# EAGLE design e407-sensor-shield (EAGLE 6.4)
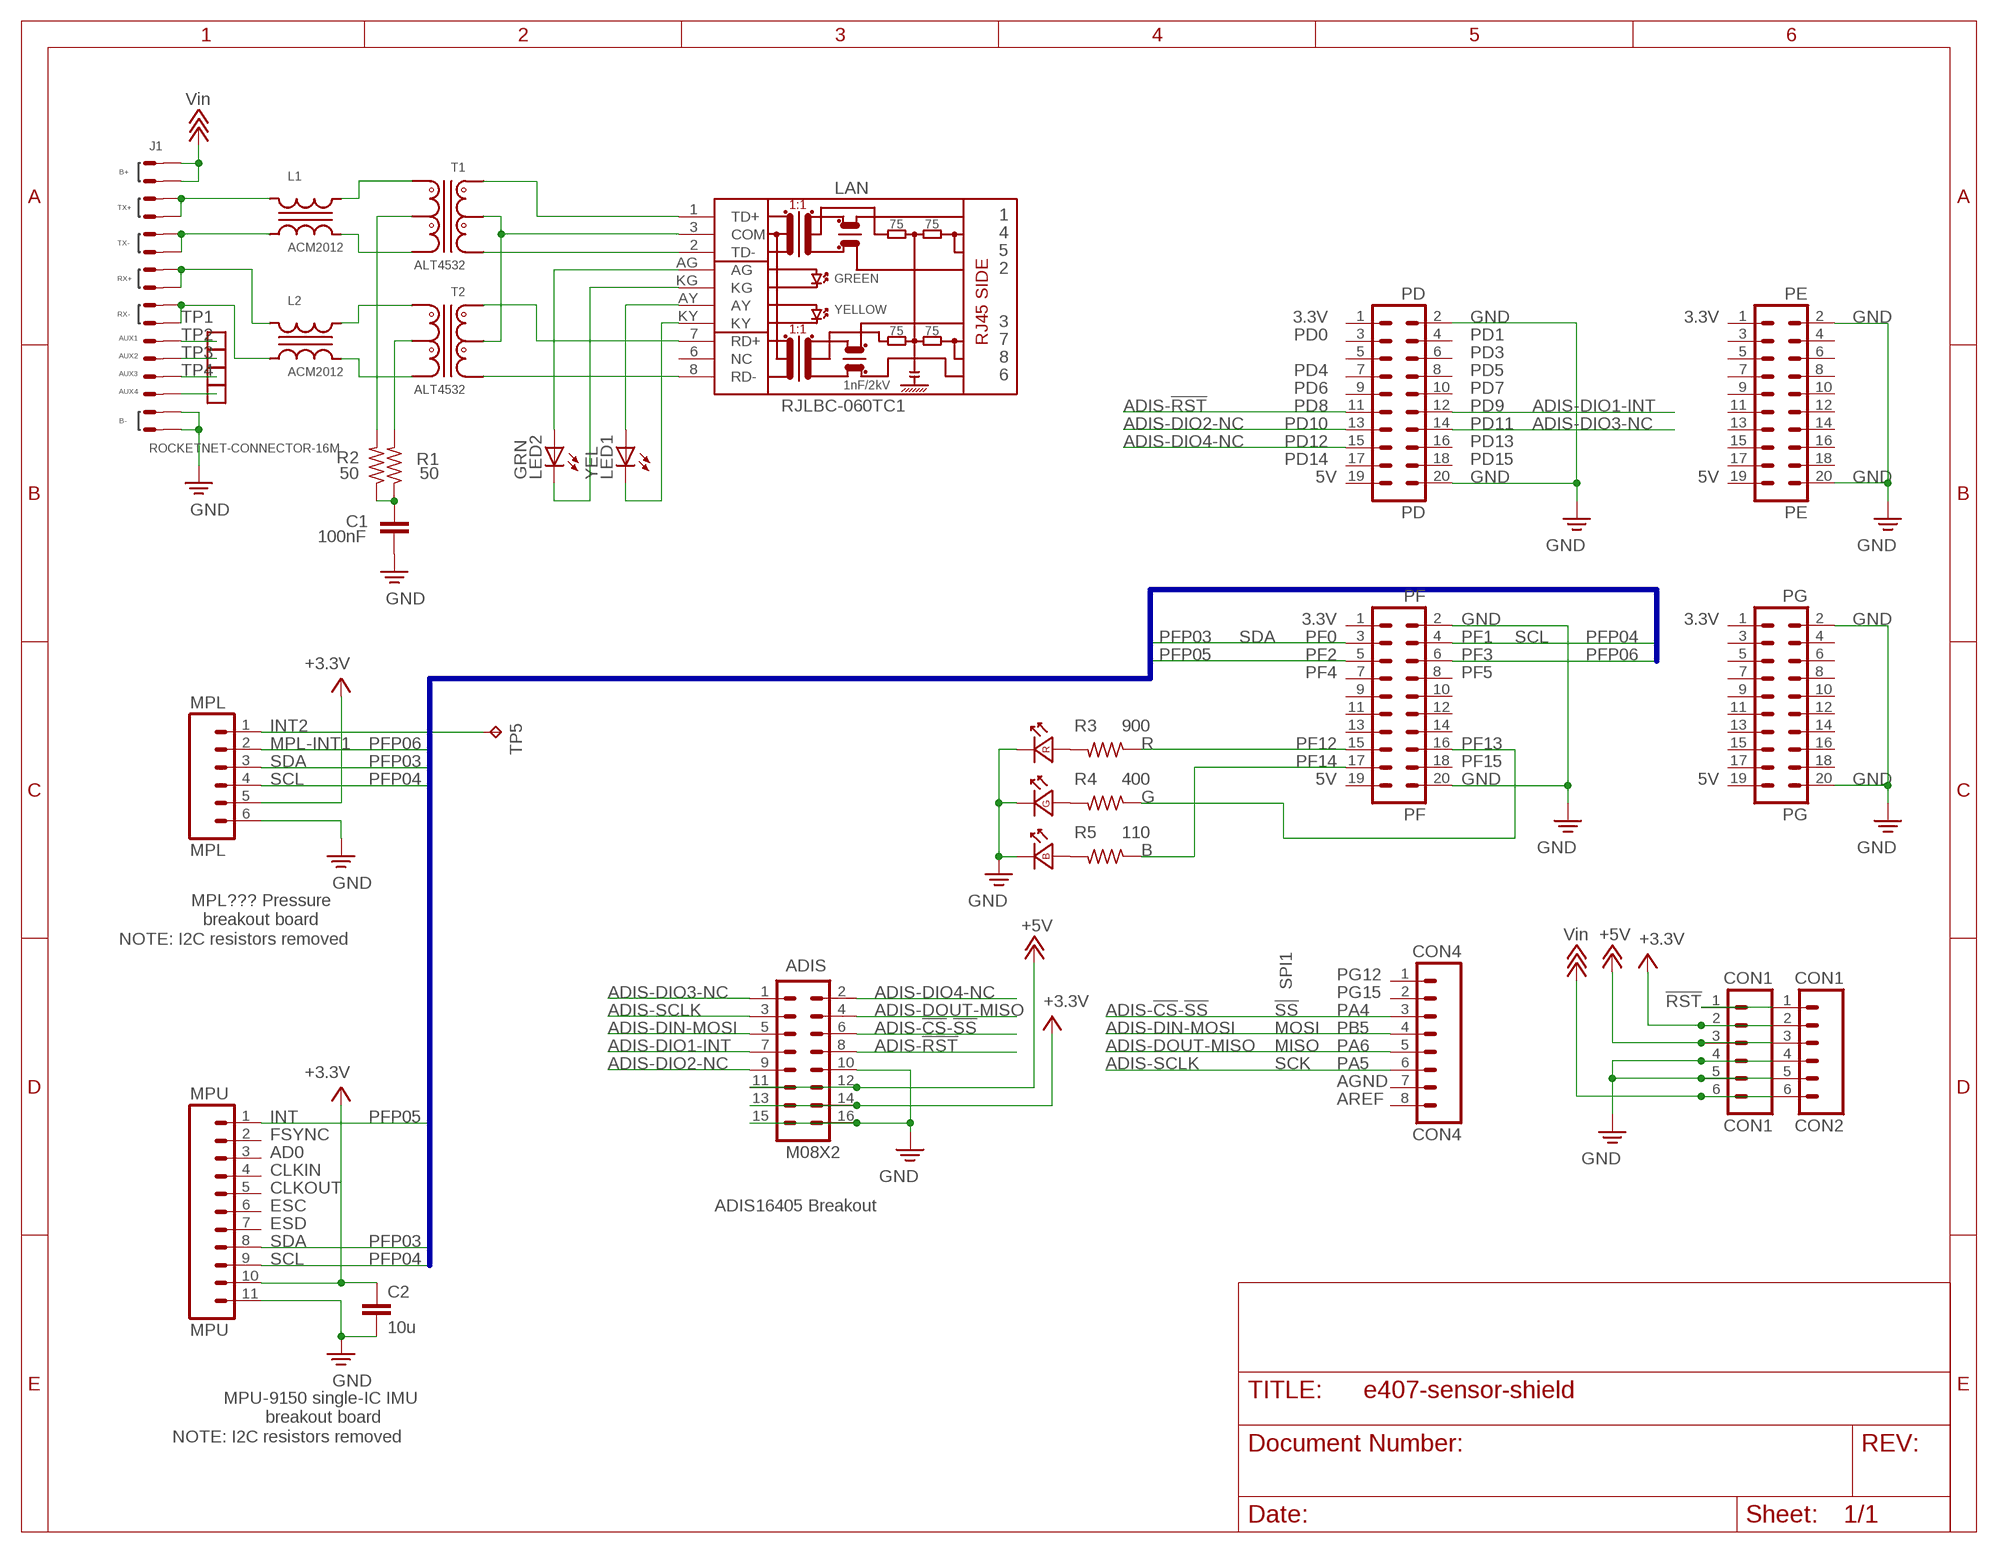
[diagram p0: schematic, sheet 1]

## Parts
ADIS  M08X2  [2X8]
C1  100nF  C-EU0603-B-NOSILK  [0603-B-NOSILK]
C2  10u  C-EU0805-B-NOSILK  [0805-B-NOSILK]
CON1  CON1  M06SIP  [1X06]
CON2  CON1  M06SIP  [1X06]
CON4  CON4  M081X08  [1X08]
J1  ROCKETNET-CONNECTOR-16M  [ROCKETNET-M-16]
L1  ACM2012  [TDK-ACM2012]
L2  ACM2012  [TDK-ACM2012]
LAN  RJLBC-060TC1  [RJLBC-060TC1]
LED1  YEL  LEDCHIPLED_0603  [CHIPLED_0603]
LED2  GRN  LEDCHIPLED_0603  [CHIPLED_0603]
LED3  LED_RGB_PLCC-6  [PLCC-6]
MPL  MPL  M06SIP  [1X06]
MPU  MPU  M11PTH  [1X11]
PD  PD  ML20  [ML20]
PE  PE  ML20  [ML20]
PF  PF  ML20  [ML20]
PG  PG  ML20  [ML20]
R1  50  R-US_0603-B-NOSILK  [0603-B-NOSILK]
R2  50  R-US_0603-B-NOSILK  [0603-B-NOSILK]
R3  900  R-US_0603-B-NOSILK  [0603-B-NOSILK]
R4  400  R-US_0603-B-NOSILK  [0603-B-NOSILK]
R5  110  R-US_0603-B-NOSILK  [0603-B-NOSILK]
T1  ALT4532  [TDK-ALT4532]
T2  ALT4532  [TDK-ALT4532]
TP1  TEST-POINT  [2MM-TEST-POINT]
TP2  TEST-POINT  [2MM-TEST-POINT]
TP3  TEST-POINT  [2MM-TEST-POINT]
TP4  TEST-POINT  [2MM-TEST-POINT]
TP5  TPPAD1-13  [P1-13]

## Nets
ADIS-!CS!-!SS: ADIS.6 CON4.3
ADIS-!RST: ADIS.8 PD.11
ADIS-DIN-MOSI: ADIS.5 CON4.4
ADIS-DIO1-INT: ADIS.7 PD.12
ADIS-DIO2-NC: ADIS.9 PD.13
ADIS-DIO3-NC: ADIS.1 PD.14
ADIS-DIO4-NC: ADIS.2 PD.15
ADIS-DOUT-MISO: ADIS.4 CON4.5
ADIS-SCLK: ADIS.3 CON4.6
B: PF.17 R5.1
DOUBLE_UP_ARROW: ADIS.11 ADIS.12 CON1.3 CON2.3 ; supply symbol labelled +5V
G: PF.16 R4.1
MPL-INT1: MPL.2 PF.6
N$3: L1.4 T1.5
N$4: CON1.1 CON2.1
N$5: L1.3 T1.4
N$6: L2.4 T2.5
N$7: L2.3 T2.4
N$8: J1.T+@13(TX+) J1.T+@14(TX+) L1.1
N$9: J1.T-@9(TX-) J1.T-@11(TX-) L1.2
N$10: J1.R+@5(RX+) J1.R+@7(RX+) L2.1
N$11: LAN.1(TD+) T1.1
N$12: LAN.2(TD-) T1.2
N$13: LAN.7(RD+) T2.1
N$14: LAN.8(RD-) T2.2
N$15: LAN.KY LED1.C
N$16: LAN.AY LED1.A
N$17: LAN.KG LED2.C
N$18: LAN.AG LED2.A
N$19: J1.R-@3(RX-) J1.R-@4(RX-) L2.2
N$20: J1.A4(AUX4) TP4.1
N$21: J1.A3(AUX3) TP3.1
N$22: J1.A2(AUX2) TP2.1
N$23: J1.A1(AUX1) TP1.1
N$24: LAN.3(COM) T1.6 T2.6
N$25: C1.1 R1.1 R2.1
N$26: R1.2 T2.3
N$27: R2.2 T1.3
N$28: LED3.1(R:A) R3.2
N$29: LED3.3(G:A) R4.2
N$30: LED3.4(B:A) R5.2
PFP03: MPL.3 MPU.8 PF.3
PFP04: MPL.4 MPU.9 PF.4
PFP05: MPU.1 PF.5
PFP07: MPL.1 TP5.TP
R: PF.15 R3.1
TRIPLE_BAR_GND: ADIS.10 ADIS.15 ADIS.16 C1.2 C2.2 CON1.4 CON1.5 CON2.4 CON2.5 J1.B-@1(B-) J1.B-@2(B-) LED3.2(G:K) LED3.5(B:K) LED3.6(R:K) MPL.6 MPU.11 PD.2 PD.20 PE.2 PE.20 PF.2 PF.20 PG.2 PG.20 ; supply symbol labelled GND
TRIPLE_UP_ARROW: CON1.6 CON2.6 J1.B+@15(B+) J1.B+@16(B+) ; supply symbol labelled Vin
UP_ARROW: ADIS.13 ADIS.14 C2.1 CON1.2 CON2.2 MPL.5 MPU.10 ; supply symbol labelled +3.3V
Unconnected: CON4.1 CON4.2 CON4.7 CON4.8 LAN.6(NC) MPU.2 MPU.3 MPU.4 MPU.5 MPU.6 MPU.7 PD.1 PD.3 PD.4 PD.5 PD.6 PD.7 PD.8 PD.9 PD.10 PD.16 PD.17 PD.18 PD.19 PE.1 PE.3 PE.4 PE.5 PE.6 PE.7 PE.8 PE.9 PE.10 PE.11 PE.12 PE.13 PE.14 PE.15 PE.16 PE.17 PE.18 PE.19 PF.1 PF.7 PF.8 PF.9 PF.10 PF.11 PF.12 PF.13 PF.14 PF.18 PF.19 PG.1 PG.3 PG.4 PG.5 PG.6 PG.7 PG.8 PG.9 PG.10 PG.11 PG.12 PG.13 PG.14 PG.15 PG.16 PG.17 PG.18 PG.19

## Buses
B$1

## Notes on the sheet
- 3.3V | GND | 3.3V | GND
- PD0 | PD1
- PD3
- PD4 | PD5
- PD6 | PD7
- PD8 | PD9
- PD10 | PD11
- PD12 | PD13
- PD14 | PD15
- 5V | GND | 5V | GND
- 3.3V | GND | 3.3V | GND
- PFP03 | SDA | PF0 | PF1 | SCL | PFP04
- PFP05 | PF2 | PF3 | PFP06
- PF4 | PF5
- INT2
- PFP06 | PF12 | PF13
- SDA | PFP03 | PF14 | PF15
- SCL | PFP04 | 5V | GND | 5V | GND
- MPL??? Pressure
  breakout board
- NOTE: I2C resistors removed
- PG12
- SPI1
- PG15
- !RST
- !SS | PA4
- MOSI | PB5
- MISO | PA6
- SCK | PA5
- AGND
- AREF
- INT | PFP05
- FSYNC
- AD0
- CLKIN
- CLKOUT
- ESC | ADIS16405 Breakout
- ESD
- SDA | PFP03
- SCL | PFP04
- MPU-9150 single-IC IMU 
  breakout board
- NOTE: I2C resistors removed

## Library data of the parts
ADIS = SparkFun-Connectors:M08X2: .1" headers, two rows of 8 each
C1 C2 = rcl_custom:C-EU: CAPACITOR, European symbol
CON1 CON2 MPL = SparkFun-Connectors:M06: Header 6 Standard 6-pin 0.1" header. Use with straight break away headers (SKU : PRT-00116), right angle break away headers (PRT-00553), swiss pins (PRT-00743), machine pins (PRT-00117), and female headers (PRT-00115). Molex polarized connector foot print use with SKU : PRT-08094 with associated crimp pins and housings. NOTES ON THE VARIANTS LOCK and LOCK_LONGPADS... This footprint was designed to help hold the alignment of a through-hole component (i.e. 6-pin header) while soldering it into place. You may notice that each hole has been shifted either up or down by 0.005 of an inch from it's more standard position (which is a perfectly straight line). This slight alteration caused the pins (the squares in the middle) to touch the edges of the holes. Because they are alternating, it causes a "brace" to hold the component in place. 0.005 has proven to be the perfect amount of "off-center" position when using our standard breakaway headers. Although looks a little odd when you look at the bare footprint, once you have a header in there, the alteration is very hard to notice. Also, if you push a header all the way into place, it is covered up entirely on the bottom side. This idea of altering the position of holes to aid alignment will be further integrated into the Sparkfun Library for other footprints. It can help hold any component with 3 or more connection pins.
CON4 = SparkFun-Connectors:M08: Header 8 Standard 8-pin 0.1" header. Use with straight break away headers (SKU : PRT-00116), right angle break away headers (PRT-00553), swiss pins (PRT-00743), machine pins (PRT-00117), and female headers (PRT-00115).
J1 = rocketnet-connector:ROCKETNET-CONNECTOR-16
L1 L2 = magnetics:ACM2012
LAN = OLIMEX_CONNECTORS:RJLBC-060TC1
LED1 LED2 = led:LED: LED OSRAM: - CHIPLED LG R971, LG N971, LY N971, LG Q971, LY Q971, LO R971, LY R971 LH N974, LH R974 LS Q976, LO Q976, LY Q976 LO Q996 - Hyper CHIPLED LW Q18S LB Q993, LB Q99A, LB R99A - SideLED LS A670, LO A670, LY A670, LG A670, LP A670 LB A673, LV A673, LT A673, LW A673 LH A674 LY A675 LS A676, LA A676, LO A676, LY A676, LW A676 LS A679, LY A679, LG A679 - Hyper Micro SIDELED® LS Y876, LA Y876, LO Y876, LY Y876 LT Y87S - SmartLED LW L88C, LW L88S LB L89C, LB L89S, LG L890 LS L89K, LO L89K, LY L89K LS L896, LA L896, LO L896, LY L896 - TOPLED LS T670, LO T670, LY T670, LG T670, LP T670 LSG T670, LSP T670, LSY T670, LOP T670, LYG T670 LG T671, LOG T671, LSG T671 LB T673, LV T673, LT T673, LW T673 LH T674 LS T676, LA T676, LO T676, LY T676, LB T676, LH T676, LSB T676, LW T676 LB T67C, LV T67C, LT T67C, LS T67K, LO T67K, LY T67K, LW E67C LS E67B, LA E67B, LO E67B, LY E67B, LB E67C, LV E67C, LT E67C LW T67C LS T679, LY T679, LG T679 LS T770, LO T770, LY T770, LG T770, LP T770 LB T773, LV T773, LT T773, LW T773 LH T774 LS E675, LA E675, LY E675, LS T675 LS T776, LA T776, LO T776, LY T776, LB T776 LHGB T686 LT T68C, LB T68C - Hyper Mini TOPLED® LB M676 - Mini TOPLED Santana® LG M470 LS M47K, LO M47K, LY M47K Source: http://www.osram.convergy.de LUXEON: - LUMILED® LXK2-PW12-R00, LXK2-PW12-S00, LXK2-PW14-U00, LXK2-PW14-V00 LXK2-PM12-R00, LXK2-PM12-S00, LXK2-PM14-U00 LXK2-PE12-Q00, LXK2-PE12-R00, LXK2-PE12-S00, LXK2-PE14-T00, LXK2-PE14-U00 LXK2-PB12-K00, LXK2-PB12-L00, LXK2-PB12-M00, LXK2-PB14-N00, LXK2-PB14-P00, LXK2-PB14-Q00 LXK2-PR12-L00, LXK2-PR12-M00, LXK2-PR14-Q00, LXK2-PR14-R00 LXK2-PD12-Q00, LXK2-PD12-R00, LXK2-PD12-S00 LXK2-PH12-R00, LXK2-PH12-S00 LXK2-PL12-P00, LXK2-PL12-Q00, LXK2-PL12-R00 Source: www.luxeon.com KINGBRIGHT: KA-3528ASYC Source: www.kingbright.com
LED3 = Tova:LED_RGB_*: RGB LED with separate contacts for all 3 chips
MPU = SparkFun-Connectors:M11: Header 11 Standard 11-pin 0.1" header. Use with straight break away headers (SKU : PRT-00116), right angle break away headers (PRT-00553), swiss pins (PRT-00743), machine pins (PRT-00117), and female headers (PRT-00115).
PD PE PF PG = con-harting-ml:ML20: HARTING; OC_FARNELL: unknown; OC_NEWARK: unknown
R1-R5 = rcl_custom:R-US_: RESISTOR, American symbol
T1 T2 = magnetics:ALT4532
TP1-TP4 = apdm:TEST-POINT
TP5 = testpad:TP: Test pad

## Net classes
1 PWR: width 0.203 mm, drill 0.4 mm, clearance 0.076 mm

## Board
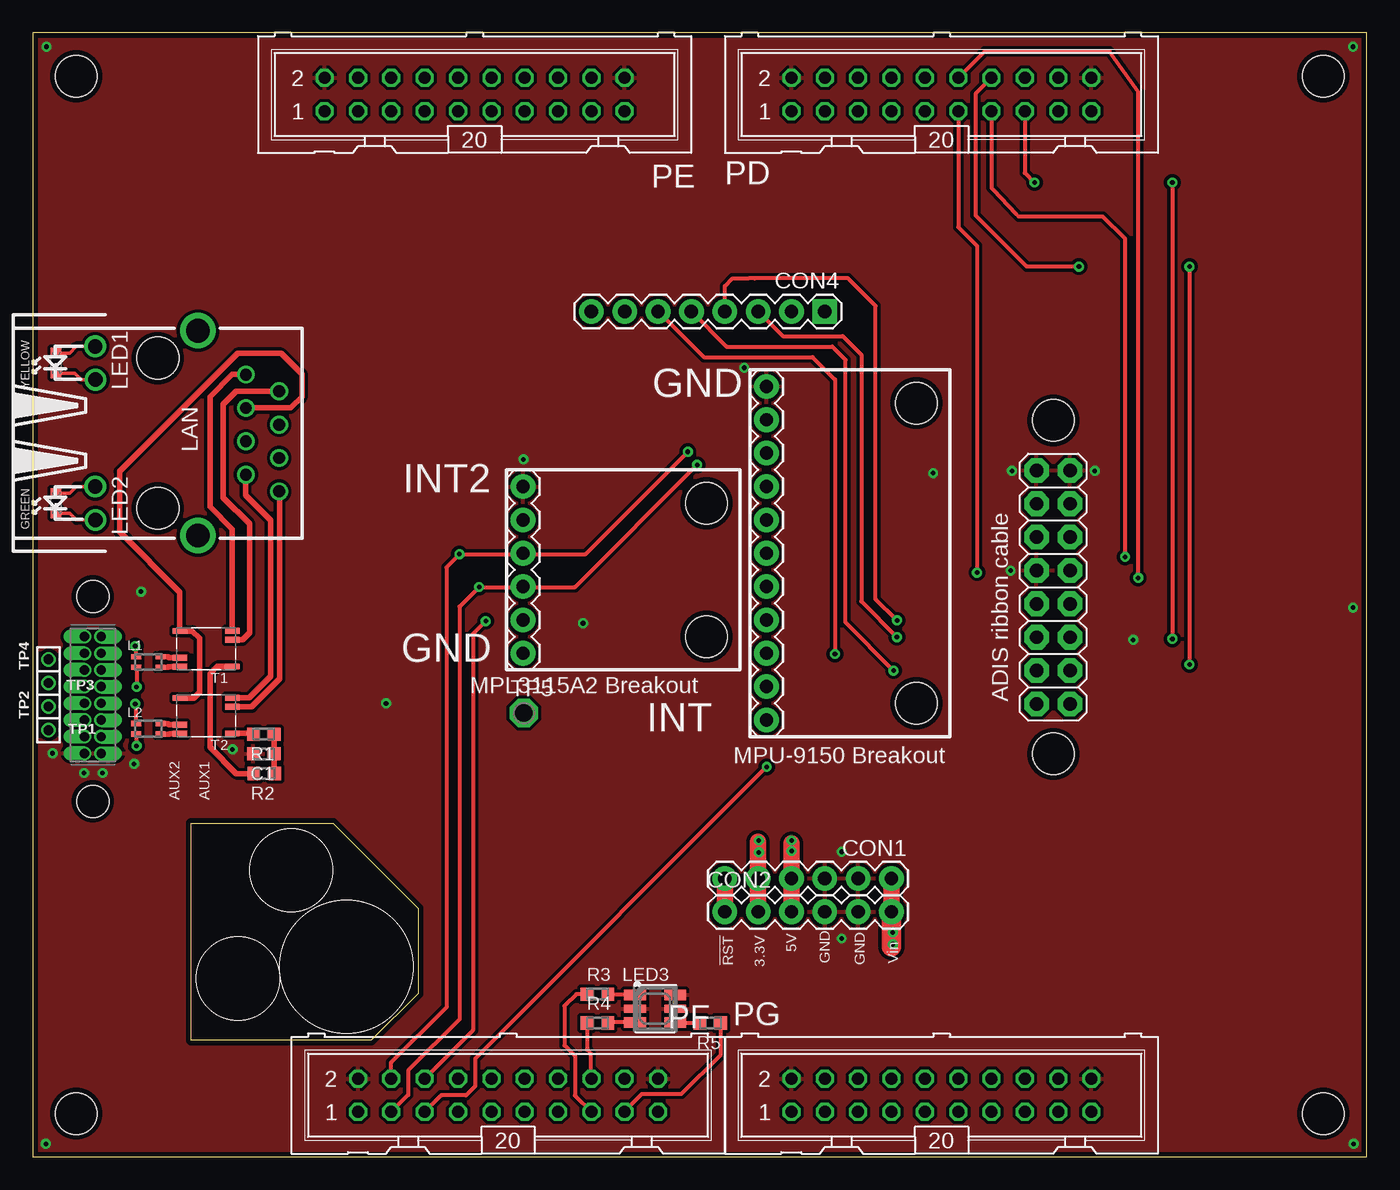
[diagram p1: board, top side]
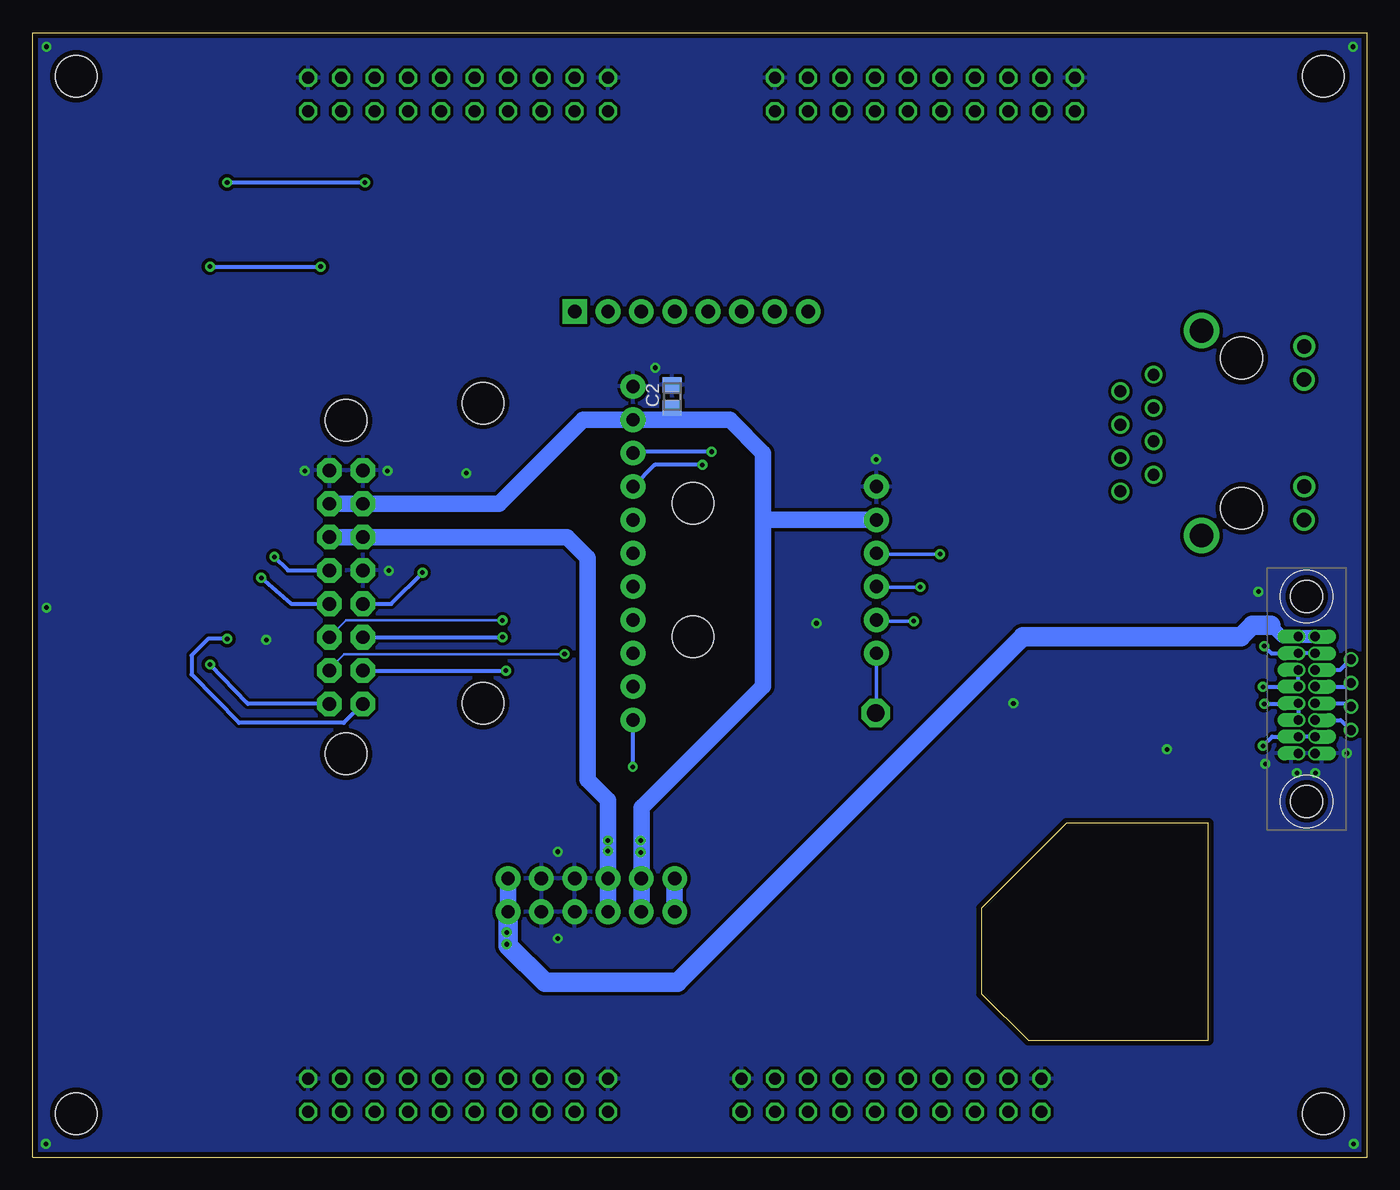
[diagram p2: board, bottom side, seen from below]

Size 101.6 x 85.6 mm. Coordinates in mm from the lower left corner, seen from the top.
Outline: 101.6,0 0,0 0,85.6 101.6,85.6 101.6,0
Outline: 25.78,8.89 12.06,8.89 12.06,25.4 22.86,25.4 29.34,18.92 29.34,12.45 25.78,8.89
Copper layers (1*16): Top 0.0178mm / dielectric 59mil / Bottom 0.0178mm
Design rules "epl-lpkf *": minimum track width 8mil, minimum drill 0.35mm, track to track 8mil, track to pad 8mil, pad to pad 8mil, via to via 8mil, smd to smd 8mil, copper to edge 15mil, drill to drill 15mil, minimum pad ring 0mil, minimum via ring 8mil, stop-mask expansion 3mil, vias tented up to drill 0mil, thermal gap 10mil
Holes 3.17 mm at 98.3,3.3 98.3,82.3 3.3,82.3 3.3,3.3 51.31,39.62 51.31,49.78 67.31,34.54 67.31,57.4 77.73,30.69 77.73,56.09

### Footprints (pad centres in the part's own frame; a part is rotated, then mirrored left to right if it is on the bottom)
2X8 = drill 1.016 pad 1.88 octagon: 1 0,0; 2 0,2.54; 3 2.54,0; 4 2.54,2.54; 5 5.08,0; 6 5.08,2.54; 7 7.62,0; 8 7.62,2.54; 9 10.16,0; 10 10.16,2.54; 11 12.7,0; 12 12.7,2.54; 13 15.24,0; 14 15.24,2.54; 15 17.78,0; 16 17.78,2.54
0603-B-NOSILK = smd 0.95 x 1: 1 -0.8,0; 2 0.8,0
0805-B-NOSILK = smd 1.15 x 1.45: 1 -0.9,0; 2 0.9,0
1X06 = drill 1.016 pad 1.88: 1 0,0; 2 2.54,0; 3 5.08,0; 4 7.62,0; 5 10.16,0; 6 12.7,0
1X08 = drill 1.016 pad 1.88 square: 1 0,0 | drill 1.016 pad 1.88: 2 2.54,0; 3 5.08,0; 4 7.62,0; 5 10.16,0; 6 12.7,0; 7 15.24,0; 8 17.78,0
ROCKETNET-M-16 = drill 0.71 pad 0.95 offset: A1 -1.905,0.635; A2 -0.635,0.635; A3 0.635,0.635; A4 1.905,0.635; B+@15 4.445,-0.635; B+@16 4.445,0.635; B-@1 -4.445,-0.635; B-@2 -4.445,0.635; R+@5 -1.905,-0.635; R+@7 -0.635,-0.635; R-@3 -3.175,-0.635; R-@4 -3.175,0.635; T+@13 3.175,-0.635; T+@14 3.175,0.635; T-@9 0.635,-0.635; T-@11 1.905,-0.635 | hole 2.438: 7.5,0; -8.1,0
TDK-ACM2012 = smd 0.75 x 0.4: 1 -0.925,0.4; 2 -0.925,-0.4; 3 0.925,-0.4; 4 0.925,0.4
RJLBC-060TC1 = drill 0.9: 1 -4.455,6.7; 2 -3.185,9.24; 3 -1.915,6.7; 4 -0.645,9.24; 5 0.625,6.7; 6 1.895,9.24; 7 3.165,6.7; 8 4.435,9.24 | drill 1.1: AG 4.07,-4.773; AY -6.61,-4.773; KG 6.61,-4.748; KY -4.07,-4.748 | drill 1.8: GND1 -7.8,3.05; GND2 7.8,3.05 | hole 3.2: -5.715,0; 5.715,0
CHIPLED_0603 = smd 0.8 x 0.8: A 0,-0.75; C 0,0.75
PLCC-6 = smd 1.65 x 0.8: 1 -1.525,1.05; 3 -1.525,-1.05; 4 1.525,-1.05; 6 1.525,1.05 | smd 1.65 x 0.6: 2 -1.525,0; 5 1.525,0
1X11 = drill 1.016 pad 1.88: 1 0,0; 2 2.54,0; 3 5.08,0; 4 7.62,0; 5 10.16,0; 6 12.7,0; 7 15.24,0; 8 17.78,0; 9 20.32,0; 10 22.86,0; 11 25.4,0
ML20 = drill 0.914 octagon: 1 -11.43,-1.27; 2 -11.43,1.27; 3 -8.89,-1.27; 4 -8.89,1.27; 5 -6.35,-1.27; 6 -6.35,1.27; 7 -3.81,-1.27; 8 -3.81,1.27; 9 -1.27,-1.27; 10 -1.27,1.27; 11 1.27,-1.27; 12 1.27,1.27; 13 3.81,-1.27; 14 3.81,1.27; 15 6.35,-1.27; 16 6.35,1.27; 17 8.89,-1.27; 18 8.89,1.27; 19 11.43,-1.27; 20 11.43,1.27
TDK-ALT4532 = smd 1.1 x 0.45: 1 -2,-1.375; 2 -2,-0.675; 3 -2,1.35; 4 2,1.375; 5 2,0.675; 6 2,-1.35
2MM-TEST-POINT = drill 0.737: 1 0,0
P1-13 = drill 1.321 pad 2.159 octagon: TP 0,0

### Placement (x,y rotation side)
ADIS  79,34.5 90 top
C1  17.6,30.7 180 top
C2  52.9,57.9 90 bottom
CON1  52.7,21.21 0 top
CON2  52.7,18.67 0 top
CON4  60.33,64.39 180 top
J1  4.57,35.18 90 top
L1  8.8,37.7 0 top
L2  8.8,32.6 0 top
LAN  9.53,55.12 270 top
LED1  1.78,60.45 180 top
LED2  1.78,49.78 180 top
LED3  47.4,11.3 0 top
MPL  37.34,38.35 90 top
MPU  55.88,33.27 90 top
PD  69.22,80.9 0 top
PE  33.66,80.9 0 top
PF  36.2,4.7 0 top
PG  69.22,4.7 0 top
R1  17.6,32.2 180 top
R2  17.63,29.2 180 top
R3  43,12.4 0 top
R4  43,10.2 0 top
R5  51.6,10.2 180 top
T1  13.2,38.7 180 top
T2  13.2,33.6 180 top
TP1  1.2,32.5 0 top
TP2  1.2,34.3 0 top
TP3  1.2,36.1 0 top
TP4  1.2,37.9 0 top
TP5  37.4,33.8 0 top

### Tracks (layer width: path | path; a pad name or v marks a point on that pad's centre or on a via)
ADIS-!CS!-!SS  (via drill 0.35)
  Top 0.3: CON4.3 57.13,62.5 61.7,62.5 63.1,61.1 63.1,42.3 v65.82,39.58
  Bottom 0.3: ADIS.6 v65.82,39.58
ADIS-!RST  (via drill 0.35)
  Top 0.3: PD.11 70.48,70.81 71.92,69.37 v71.92,44.5
  Bottom 0.3: ADIS.8 74.31,42.12 v71.92,44.5
ADIS-DIN-MOSI  (via drill 0.35)
  Top 0.3: v65.83,40.85 64.2,42.48 64.2,64.8 62.1,66.9 55,66.9 54.5,66.9 53.3,66.9 52.7,66.31 CON4.4
  Bottom 0.203: ADIS.5 77.73,40.85 v65.83,40.85
ADIS-DIO1-INT  (via drill 0.35)
  Top 0.3: v84.2,44.1 84.2,81.1 82,84.2 72.52,84.2 PD.12
  Bottom 0.3: v84.2,44.1 81.93,42.13 ADIS.7
  Bottom 0.35: ADIS.7
ADIS-DIO2-NC  (via drill 0.35)
  Top 0.254: 75.1,71.6 74.9,71.8 | 73.03,73.79 73.16,73.66
  Top 0.3: v83.2,45.7 83.2,69.9 81.5,71.6 75.1,71.6 | 74.9,71.8 73.16,73.66 | PD.13 73.03,73.79
  Bottom 0.254: ADIS.9
  Bottom 0.3: v83.2,45.7 82.17,44.67 ADIS.9
ADIS-DIO3-NC  (via drill 0.35)
  Top 0.3: PD.14 71.8,80.94 71.8,71.7 75.7,67.8 v79.68,67.8 | v88.1,67.8 v88.1,37.5
  Bottom 0.254: 85.2,34.5 85.3,34.6 | v79.68,67.8
  Bottom 0.3: v88.1,37.5 85.3,34.6 | ADIS.1 85.2,34.5 | v88.1,67.8 v79.68,67.8
ADIS-DIO4-NC  (via drill 0.35)
  Top 0.3: PD.15 75.56,74.94 v76.3,74.2 | v86.8,74.2 v86.8,39.45
  Bottom 0.3: v76.3,74.2 v86.8,74.2 | v86.8,39.45 88.25,39.45 89.5,38.2 89.5,36.75 85.9,33.05 77.91,33.05 ADIS.2
ADIS-DOUT-MISO  (via drill 0.35)
  Top 0.3: v65.56,37.04 61.9,40.7 61.9,60.7 60.9,61.7 52.85,61.7 CON4.5
  Bottom 0.3: ADIS.4 v65.56,37.04
ADIS-SCLK  (via drill 0.35)
  Top 0.3: CON4.6 51.11,60.9 59.4,60.9 61.1,59.2 v61.1,38.3
  Bottom 0.203: v61.1,38.3 77.9,38.3 79,37.2
  Bottom 0.3: 79,37.2 ADIS.3
B
  Top 0.3: PF.17 45.09,3.48 46.4,4.8 49.4,4.8 52.4,7.8 R5.1
DOUBLE_UP_ARROW  (via drill 0.35)
  Top 0.3: v57.8,24.1 57.8,23.9
  Top 1.27: CON2.3 CON1.3 57.8,21.22 v57.8,23.3 57.8,23.9
  Bottom 0.254: 76.72,47.2 ADIS.12 77.03,47.2 77.02,47.18
  Bottom 1.27: 77.03,47.2 ADIS.11 | 77.02,47.18 60.9,47.18 59.35,45.63 59.35,28.73 57.78,27.16 CON1.3 CON2.3
G
  Top 0.3: R4.1 42.2,8.2 42.5,7.9 42.5,6.01 PF.16
MPL-INT1  (via drill 0.35)
  Top 0.254: PF.6 29.87,5.97 | PF.6
  Top 0.3: v34.5,40.8 33.53,39.83 33.53,9.65 PF.6
  Bottom 0.254: v34.5,40.8 37.24,40.8 MPL.2
N$3
  Top 0.406: T1.5 10.38,38.02 10.3,38.1 L1.4
N$4
  Top 1.27: CON1.1 CON2.1
  Bottom 1.27: CON1.1 CON2.1
N$5
  Top 0.406: T1.4 10.32,37.33 10.3,37.3 L1.3
N$6
  Top 0.406: T2.5 10.38,32.92 10.3,33 L2.4
N$7
  Top 0.406: T2.4 10.43,32.23 10.4,32.2 L2.3
N$8  (via drill 0.35)
  Top 0.3: L1.1 7.88,38.9 v7.8,38.9
  Bottom 0.3: J1.T+@14 J1.T+@13 7.25,38.35 v7.8,38.9
N$9  (via drill 0.35)
  Top 0.3: L1.2 7.9,37.27 v7.9,35.8
  Bottom 0.3: J1.T-@11 J1.T-@9 7.89,35.81 v7.9,35.8
N$10  (via drill 0.35)
  Top 0.3: L2.1 7.88,34.42 v7.8,34.5
  Bottom 0.3: J1.R+@5 J1.R+@7 5.25,34.5 v7.8,34.5
N$11
  Top 0.406: T1.1 15.2,47.8 13.5,49.5 13.5,57.9 15.2,59.6 16.2,59.6 LAN.1
N$12
  Top 0.406: T1.2 15.97,39.38 16.5,39.9 16.5,48.2 14.5,50.2 14.5,57.3 15.5,58.3 LAN.2
N$13
  Top 0.406: T2.1 16.48,34.98 18.1,36.6 18.1,48.5 16.2,50.4 16.2,51.93 LAN.7
N$14
  Top 0.406: T2.2 16.68,34.27 18.8,36.4 18.8,50.65 LAN.8
N$15
  Top 0.254: LAN.KY 3.68,59.19 3.17,59.69 LED1.C
N$16
  Top 0.254: LAN.AY 3.31,61.73 2.79,61.21 1.79,61.21 LED1.A
N$17
  Top 0.254: LAN.KG 3.31,48.51 2.79,49.02 LED2.C
N$18
  Top 0.254: LAN.AG 3.3,51.05 2.79,50.55 1.79,50.55 LED2.A
N$19  (via drill 0.35)
  Top 0.3: L2.2 7.88,31.32 v7.9,31.3
  Bottom 0.3: J1.R-@4 J1.R-@3 7.2,32 v7.9,31.3
N$20
  Bottom 0.3: J1.A4 2.02,37.08 TP4.1
N$21
  Bottom 0.3: J1.A3 1.49,35.81 TP3.1
N$22
  Bottom 0.3: J1.A2 1.44,34.54 TP2.1
N$23
  Bottom 0.3: J1.A1 1.97,33.27 TP1.1
N$24
  Top 0.406: T2.6 12.25,34.95 12.7,35.4 12.7,39.5 12.15,40.05 T1.6 11.2,43 6.6,47.6 6.6,52.2 15.6,61.2 18.9,61.2 20.5,59.6 20.5,57.9 19.63,57.03 LAN.3
N$25
  Top 0.406: R1.1 C1.1 18.4,29.23 R2.1
N$26
  Top 0.406: T2.3 16.78,32.25 R1.2
N$27
  Top 0.406: T1.3 14.05,37.35 13.5,36.8 13.5,31.2 15.5,29.2 R2.2
N$28
  Top 0.3: LED3.1 43.85,12.35 R3.2
N$29
  Top 0.3: LED3.3 43.85,10.25 R4.2
N$30
  Top 0.3: R5.2 48.98,10.2 LED3.4
PFP03  (via drill 0.35)
  Top 0.254: 32.5,10.47 32.47,10.47
  Top 0.3: 32.5,10.47 32.5,41.9 v34,43.4 41.3,43.4 v50.6,52.7 | 32.47,10.47 28.6,6.6 28.6,4.72 PF.3
  Bottom 0.254: v34,43.4 37.3,43.4 MPL.3
  Bottom 0.3: v50.6,52.7 54.23,52.7 MPU.8
PFP04  (via drill 0.35)
  Top 0.3: PF.4 27.3,7.21 31.5,11.4 31.5,44.9 v32.5,45.9 42.1,45.9 v49.9,53.7
  Bottom 0.254: v32.5,45.9 37.26,45.9 MPL.4
  Bottom 0.3: v49.9,53.7 55.77,53.7 MPU.9
PFP05  (via drill 0.35)
  Top 0.3: PF.5 31.12,4.7 33,4.7 33.7,5.4 33.7,7.5 v55.9,29.7
  Bottom 0.254: 55.9,33.25 MPU.1
  Bottom 0.3: v55.9,29.7 55.9,33.25
PFP07
  Bottom 0.254: MPL.1 37.34,33.86 TP5.TP
R
  Top 0.3: R3.1 41.4,12.4 40.5,11.5 40.5,8.5 41.3,7.7 41.3,4.67 PF.15
TRIPLE_BAR_GND  (via drill 0.35 pad 0.58)
  other vias: 1.04,84.54 100.56,84.54 100.6,1 1,1 41.91,40.64 37.37,53.12 68.58,52.07 74.48,44.65 100.56,41.83 26.91,34.54 83.82,39.37 8.24,43.05 74.58,52.25 80.88,52.25 15.21,31.04 61.61,23.24 61.61,16.64 1.51,30.74 7.71,29.94 3.91,29.24 5.31,29.24 54.19,60.1
  pour Bottom (isolate 0.254): 0,0 101.6,0 101.6,85.6 0,85.6
  pour Top (isolate 0.254): 0,0 0,85.6 101.6,85.6 101.6,0
TRIPLE_UP_ARROW  (via drill 0.35)
  Top 0.254: v65.5,17.1 65.5,16.9 65.4,16.9 | v65.5,16.2 65.5,16.3 65.4,16.3
  Top 1.27: CON1.6 65.41,18.85 | 65.41,18.85 CON2.6 | 65.41,18.85 65.4,18.84
  Top 1.5: 65.4,18.84 65.4,16.9 65.4,16.3 65.4,16
  Bottom 1: J1.B+@16 J1.B+@15 6.42,39.62 7.3,40.5 | CON2.6
  Bottom 1.27: CON1.6 CON2.6
  Bottom 1.5: CON2.6 65.4,16.1 62.6,13.3 52.5,13.3 26.18,39.6 9.6,39.6 8.7,40.5 7.3,40.5
UP_ARROW  (via drill 0.35)
  Top 0.3: v55.3,23.2 v55.3,24.1 | v55.3,24.1 | v55.3,24.1 55.23,24.1 55.23,24 55.24,24
  Top 1.27: CON2.2 CON1.2 55.24,24
  Bottom 0.254: 54.9,26.9 55.08,26.75 55.14,26.69 55.22,26.61 | C2.1 52.9,56.13 53,56.13
  Bottom 1.27: 55.22,26.61 CON1.2 CON2.2 | ADIS.13 ADIS.14 66.08,49.74 59.69,56.13 MPU.10 53,56.13 48.51,56.13 45.97,53.59 45.97,48.51 | MPL.5 45.97,48.51 | 45.98,48.51 45.97,48.51 | 45.97,48.51 45.97,35.85 55.14,26.69

### Text on the board
tPlace: GND | INT2 | GND | MPL3115A2 Breakout | ADIS ribbon cable | INT | MPU-9150 Breakout | AUX2 | AUX1 | 5V | !RST | GND | GND | Vin | 3.3V
tDocu: TOP | TOP | TOP | TOP | TOP | TOP | TOP